# EAGLE design main (EAGLE 9.6.2)
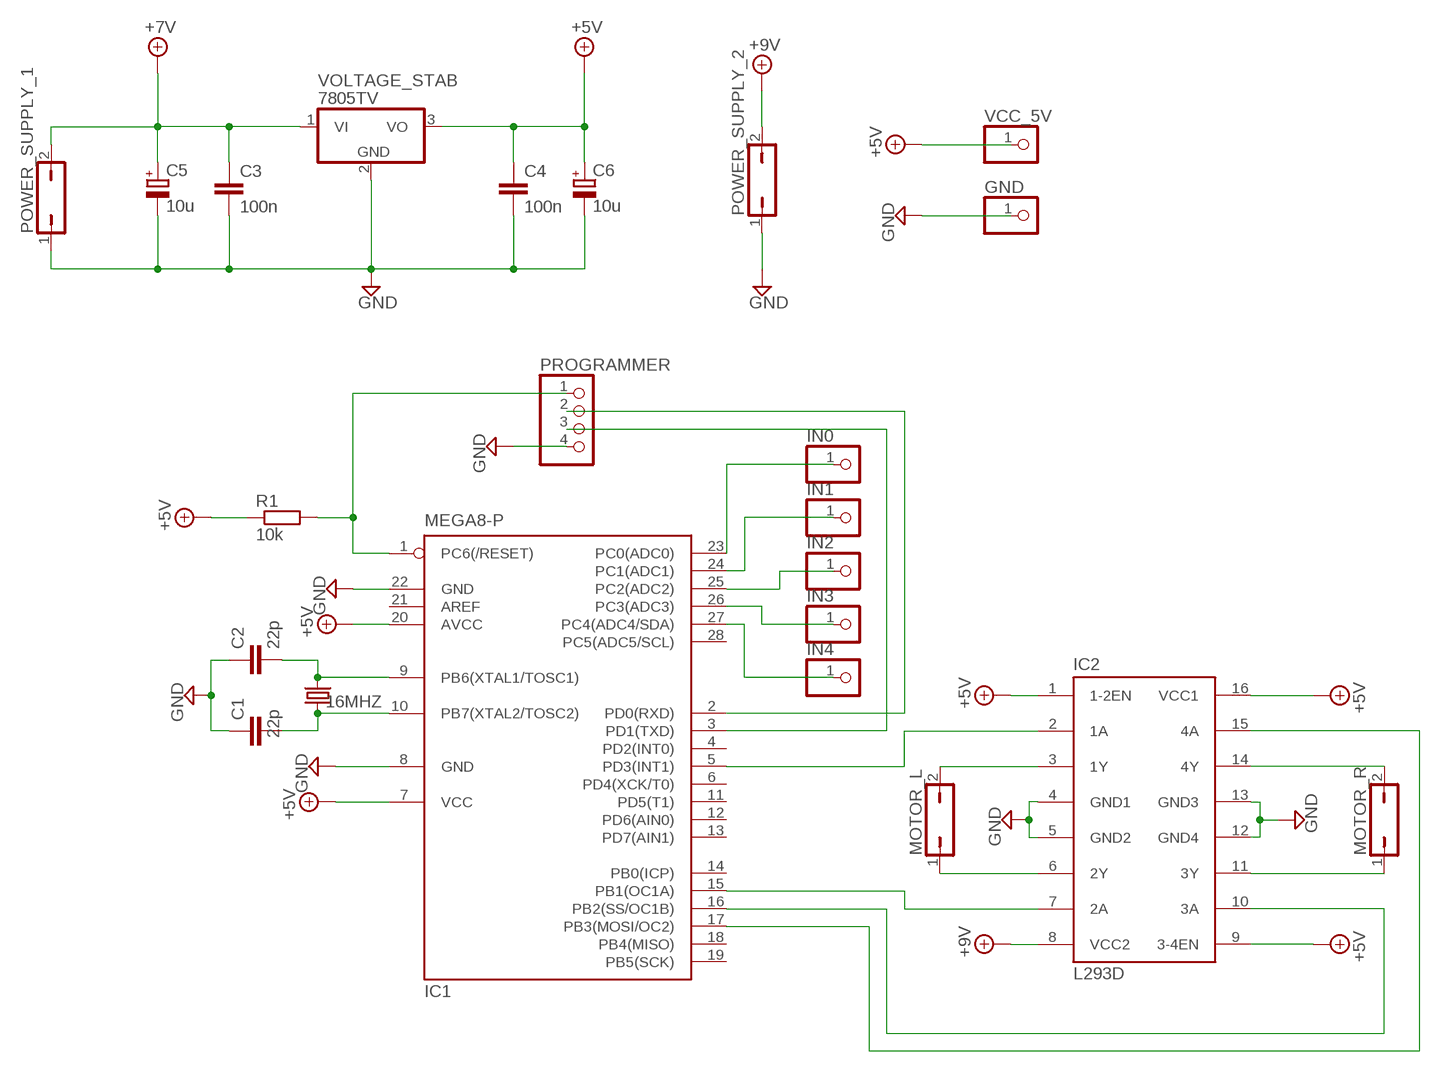
[diagram p0: schematic, sheet 1]

## Parts
16MHZ  CRYSTALHC49S  [HC49/S]
C1  22p  C-EU025-030X050  [C025-030X050]
C2  22p  C-EU025-030X050  [C025-030X050]
C3  100n  C-EU025-030X050  [C025-030X050]
C4  100n  C-EU025-030X050  [C025-030X050]
C5  10u  CPOL-EUE2.5-7  [E2,5-7]
C6  10u  CPOL-EUE2.5-7  [E2,5-7]
GND  PINHD-1X1  [1X01]
IC1  MEGA8-P  [DIL28-3]
IC2  L293D  [DIL16]
IN0  PINHD-1X1  [1X01]
IN1  PINHD-1X1  [1X01]
IN2  PINHD-1X1  [1X01]
IN3  PINHD-1X1  [1X01]
IN4  PINHD-1X1  [1X01]
MOTOR_L  JP1Q  [JP1]
MOTOR_R  JP1Q  [JP1]
POWER_SUPPLY_1  JP1Q  [JP1]
POWER_SUPPLY_2  JP1Q  [JP1]
PROGRAMMER  PINHD-1X4  [1X04]
R1  10k  R-EU_0204/5  [0204/5]
VCC_5V  PINHD-1X1  [1X01]
VOLTAGE_STAB  7805TV  [TO220V]

## Nets
+5V: C4.1 C6.+ IC1.7(VCC) IC1.20(AVCC) IC2.1(1-2EN) IC2.9(3-4EN) IC2.16(VCC1) R1.1 VCC_5V.1 VOLTAGE_STAB.3(VO)
+7V: C3.1 C5.+ POWER_SUPPLY_1.2 VOLTAGE_STAB.1(VI)
+9V: IC2.8(VCC2) POWER_SUPPLY_2.2
GND: C1.1 C2.1 C3.2 C4.2 C5.- C6.- GND.1 IC1.8(GND) IC1.22(GND) IC2.4(GND1) IC2.5(GND2) IC2.12(GND4) IC2.13(GND3) POWER_SUPPLY_1.1 POWER_SUPPLY_2.1 PROGRAMMER.4 VOLTAGE_STAB.2(GND)
MOTOR_L_1: IC1.5(PD3(INT1)) IC2.2(1A)
MOTOR_L_2: IC1.15(PB1(OC1A)) IC2.7(2A)
MOTOR_R2: IC1.17(PB3(MOSI/OC2)) IC2.15(4A)
MOTOR_R_1: IC1.16(PB2(SS/OC1B)) IC2.10(3A)
N$1: IC2.11(3Y) MOTOR_R.1
N$2: IC2.14(4Y) MOTOR_R.2
N$3: IC2.3(1Y) MOTOR_L.2
N$4: IC2.6(2Y) MOTOR_L.1
N$5: 16MHZ.2 C2.2 IC1.9(PB6(XTAL1/TOSC1))
N$6: 16MHZ.1 C1.2 IC1.10(PB7(XTAL2/TOSC2))
N$7: IC1.23(PC0(ADC0)) IN0.1
N$8: IC1.24(PC1(ADC1)) IN1.1
N$9: IC1.25(PC2(ADC2)) IN2.1
N$10: IC1.27(PC4(ADC4/SDA)) IN4.1
N$11: IC1.26(PC3(ADC3)) IN3.1
N$13: IC1.3(PD1(TXD)) PROGRAMMER.3
N$14: IC1.2(PD0(RXD)) PROGRAMMER.2
RESET: IC1.1(PC6(/RESET)) PROGRAMMER.1 R1.2
Unconnected: IC1.4(PD2(INT0)) IC1.6(PD4(XCK/T0)) IC1.11(PD5(T1)) IC1.12(PD6(AIN0)) IC1.13(PD7(AIN1)) IC1.14(PB0(ICP)) IC1.18(PB4(MISO)) IC1.19(PB5(SCK)) IC1.21(AREF) IC1.28(PC5(ADC5/SCL))

## Library data of the parts
16MHZ = crystal:CRYSTAL: CRYSTAL; OC_FARNELL: 1667008; OC_NEWARK: unknown
C1-C4 = rcl:C-EU: CAPACITOR, European symbol; SPICEPREFIX: C
C5 C6 = rcl:CPOL-EU: POLARIZED CAPACITOR, European symbol; SPICEPREFIX: C
GND IN0 IN1-IN4 VCC_5V = pinhead:PINHD-1X1: PIN HEADER
IC1 = atmel:MEGA8-P: MICROCONTROLLER 8 Kbytes FLASH, 1 kbytes SRAM, 512 bytes EEPROM, USART, 4-channel 10 bit ADC, 2-channel 8 bit ADC Pin compatible with Atmega48, ATMega88, ATMega168 Source: avr.lbr; OC_FARNELL: unknown; OC_NEWARK: unknown
IC2 = st-microelectronics:L293D: PUSH-PULL 4 CHANNEL DRIVER; MPN: L293D; OC_FARNELL: 9589619; OC_NEWARK: 56P8249
MOTOR_L MOTOR_R POWER_SUPPLY_1 POWER_SUPPLY_2 = jumper:JP1Q: JUMPER
PROGRAMMER = pinhead:PINHD-1X4: PIN HEADER
R1 = rcl:R-EU_: RESISTOR, European symbol; SPICEPREFIX: R
VOLTAGE_STAB = linear:78*: Positive VOLTAGE REGULATOR Source: http://cache.national.com/ds/LM/LM78L05.pdf http://www.fairchildsemi.com/ds/LM/LM7805.pdf

## Board
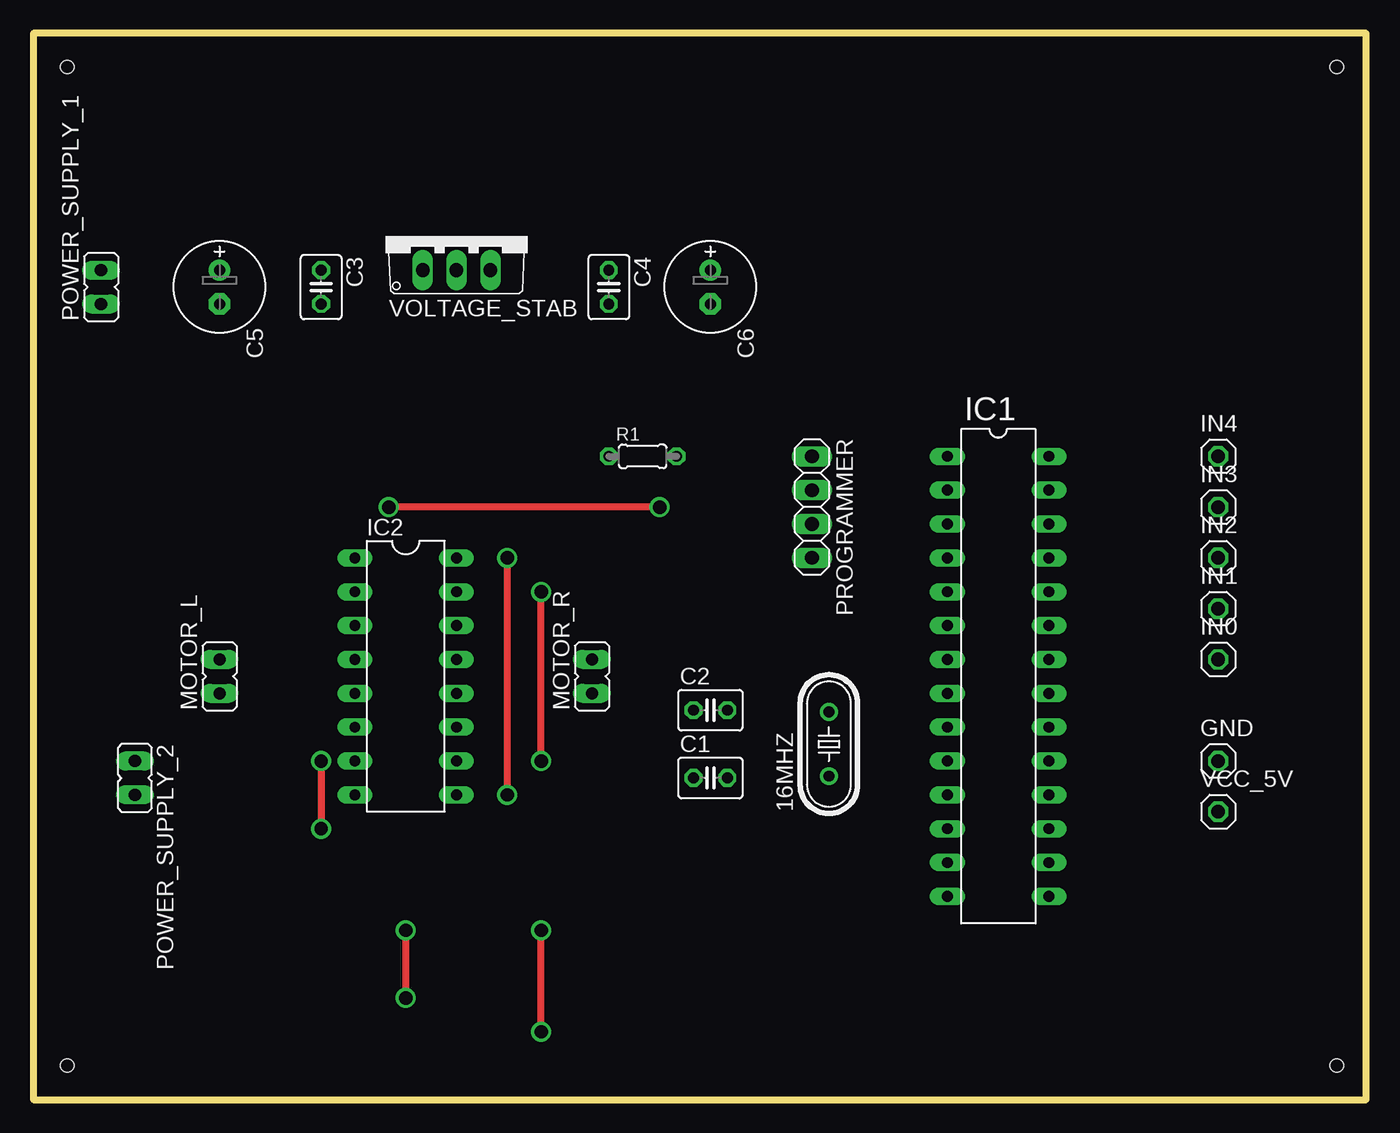
[diagram p1: board, top side]
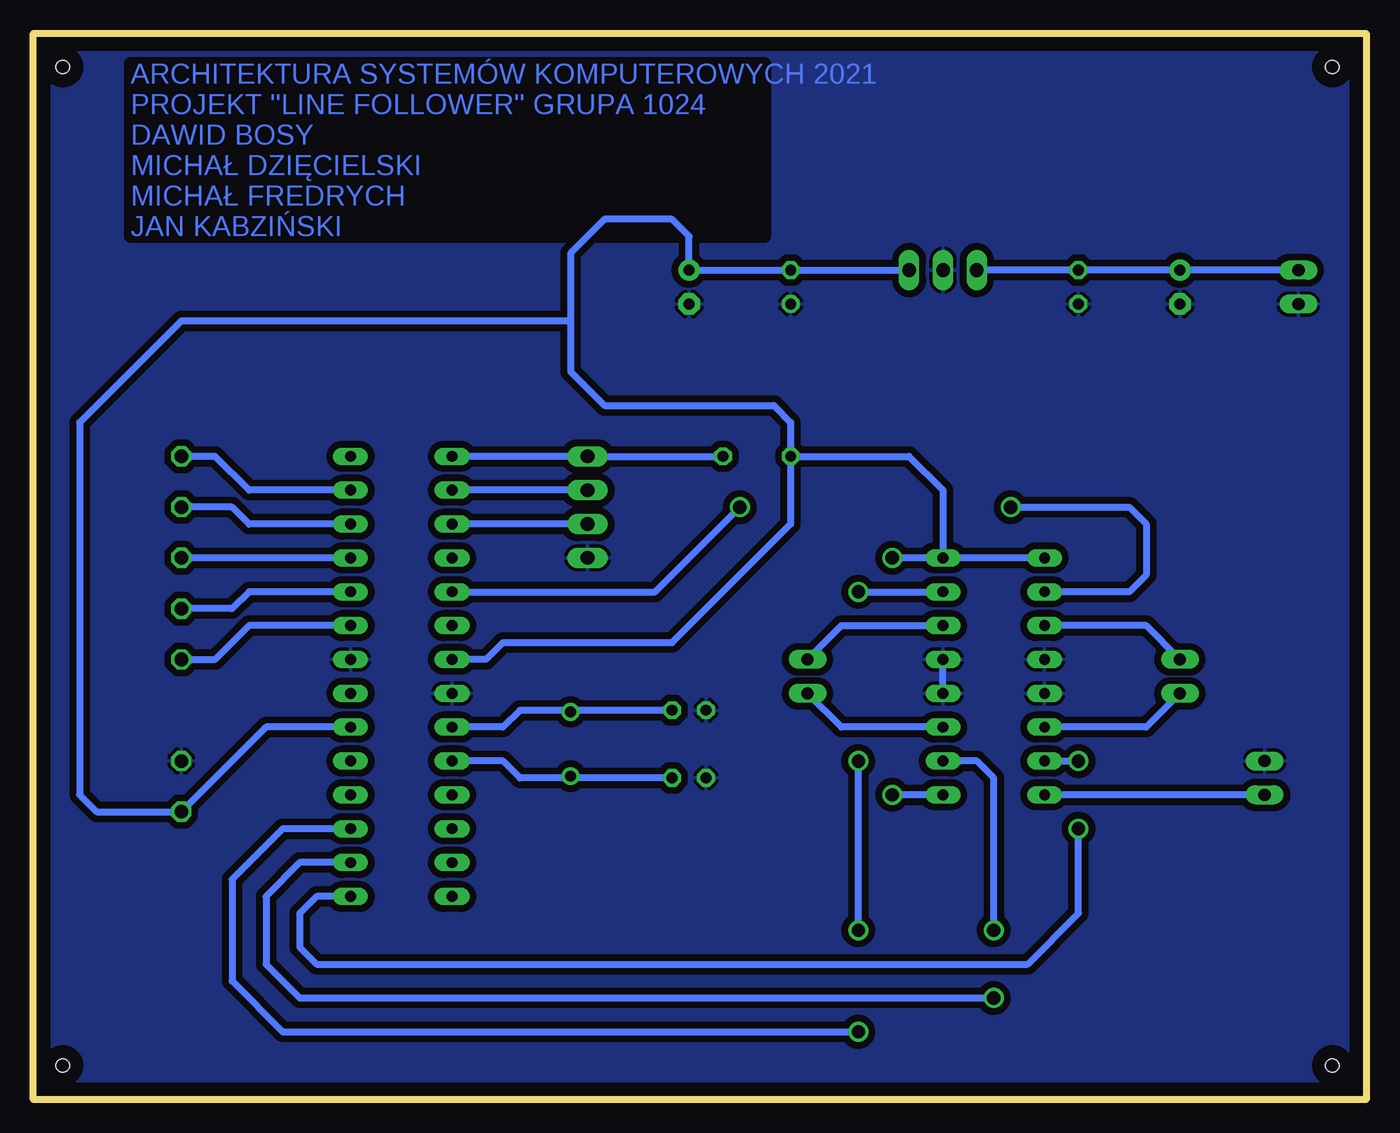
[diagram p2: board, bottom side, seen from below]

Size 100 x 80 mm. Coordinates in mm from the lower left corner, seen from the top.
Outline: 0,0 100,0 100,80 0,80 0,0
Copper layers (1*16): Top 0.035mm / dielectric 1.5mm / Bottom 0.035mm
Design rules "default": minimum track width 6mil, minimum drill 0.35mm, track to track 6mil, track to pad 6mil, pad to pad 6mil, via to via 6mil, smd to smd 6mil, copper to edge 40mil, drill to drill 6mil, minimum pad ring 10mil, minimum via ring 8mil, stop-mask expansion 4mil, vias tented up to drill 0mil, thermal gap 10mil
Holes 1 mm at 2.54,77.47 2.54,2.54 97.79,2.54 97.79,77.47

### Footprints (pad centres in the part's own frame; a part is rotated, then mirrored left to right if it is on the bottom)
HC49/S = drill 0.813: 1 -2.413,0; 2 2.413,0
C025-030X050 = drill 0.813 octagon: 1 -1.27,0; 2 1.27,0
E2,5-7 = drill 0.813 pad 1.6: + -1.27,0 | drill 0.813 pad 1.6 octagon: - 1.27,0
1X01 = drill 1.016 octagon: 1 0,0
DIL28-3 = drill 0.813 long: 1 -16.51,-3.81; 2 -13.97,-3.81; 3 -11.43,-3.81; 4 -8.89,-3.81; 5 -6.35,-3.81; 6 -3.81,-3.81; 7 -1.27,-3.81; 8 1.27,-3.81; 9 3.81,-3.81; 10 6.35,-3.81; 11 8.89,-3.81; 12 11.43,-3.81; 13 13.97,-3.81; 14 16.51,-3.81; 15 16.51,3.81; 16 13.97,3.81; 17 11.43,3.81; 18 8.89,3.81; 19 6.35,3.81; 20 3.81,3.81; 21 1.27,3.81; 22 -1.27,3.81; 23 -3.81,3.81; 24 -6.35,3.81; 25 -8.89,3.81; 26 -11.43,3.81; 27 -13.97,3.81; 28 -16.51,3.81
DIL16 = drill 0.813 long: 1 -8.89,-3.81; 2 -6.35,-3.81; 3 -3.81,-3.81; 4 -1.27,-3.81; 5 1.27,-3.81; 6 3.81,-3.81; 7 6.35,-3.81; 8 8.89,-3.81; 9 8.89,3.81; 10 6.35,3.81; 11 3.81,3.81; 12 1.27,3.81; 13 -1.27,3.81; 14 -3.81,3.81; 15 -6.35,3.81; 16 -8.89,3.81
JP1 = drill 0.914 long: 1 0,-1.27; 2 0,1.27
1X04 = drill 1.016 long: 1 -3.81,0; 2 -1.27,0; 3 1.27,0; 4 3.81,0
0204/5 = drill 0.813 octagon: 1 -2.54,0; 2 2.54,0
TO220V = drill 1.016 long: 1 -2.54,-2.54; 2 0,-2.54; 3 2.54,-2.54

### Placement (x,y rotation side)
16MHZ  59.69,26.67 90 top
C1  50.8,24.13 0 top
C2  50.8,29.21 0 top
C3  21.59,60.96 270 top
C4  43.18,60.96 270 top
C5  13.97,60.96 270 top
C6  50.8,60.96 270 top
GND  88.9,25.4 0 top
IC1  72.39,31.75 270 top
IC2  27.94,31.75 270 top
IN0  88.9,33.02 0 top
IN1  88.9,36.83 0 top
IN2  88.9,40.64 0 top
IN3  88.9,44.45 0 top
IN4  88.9,48.26 0 top
MOTOR_L  13.97,31.75 0 top
MOTOR_R  41.91,31.75 0 top
POWER_SUPPLY_1  5.08,60.96 0 top
POWER_SUPPLY_2  7.62,24.13 180 top
PROGRAMMER  58.42,44.45 270 top
R1  45.72,48.26 0 top
VCC_5V  88.9,21.59 0 top
VOLTAGE_STAB  31.75,64.77 0 top

### Tracks (layer width: path | path; a pad name or v marks a point on that pad's centre or on a via)
+5V  (via drill 1)
  Top 0.508: v35.56,40.64 v35.56,22.86
  Bottom 0.508: VOLTAGE_STAB.3 C4.1 C6.+ 50.8,64.77 52.07,66.04 57.15,66.04 59.69,63.5 59.69,58.42 | R1.1 43.18,50.8 44.45,52.07 57.15,52.07 59.69,54.61 59.69,58.42 | R1.1 43.18,43.18 52.07,34.29 64.77,34.29 66.04,33.02 IC1.7 | IC2.1 IC2.16 | IC2.16 v35.56,40.64 | R1.1 34.29,48.26 31.75,45.72 IC2.16 | IC2.9 v35.56,22.86 | 59.69,58.42 88.9,58.42 96.52,50.8 96.52,22.86 95.25,21.59 VCC_5V.1 82.55,27.94 IC1.20
+7V
  Bottom 0.508: POWER_SUPPLY_1.2 C5.+ C3.1 VOLTAGE_STAB.1
+9V
  Bottom 0.508: POWER_SUPPLY_2.2 IC2.8
GND
  Bottom 0.508: IC2.12 IC2.13
  pour Bottom (isolate 0.508): 1.27,78.74 1.27,1.27 99.06,1.27 99.06,78.74
MOTOR_L_1  (via drill 1)
  Top 0.508: v46.99,44.45 v26.67,44.45
  Bottom 0.508: IC2.2 17.78,38.1 16.51,39.37 16.51,43.18 17.78,44.45 v26.67,44.45 | IC1.5 53.34,38.1 v46.99,44.45
MOTOR_L_2  (via drill 1)
  Top 0.508: v21.59,25.4 v21.59,20.32
  Bottom 0.508: IC2.7 v21.59,25.4 | v21.59,20.32 21.59,13.97 25.4,10.16 78.74,10.16 80.01,11.43 80.01,13.97 78.74,15.24 IC1.15
MOTOR_R2  (via drill 1)
  Top 0.508: v38.1,5.08 v38.1,12.7 | v38.1,25.4 v38.1,38.1
  Bottom 0.508: IC1.17 81.28,20.32 85.09,16.51 85.09,8.89 81.28,5.08 v38.1,5.08 | v38.1,12.7 v38.1,25.4 | v38.1,38.1 IC2.15
MOTOR_R_1  (via drill 1)
  Top 0.508: v27.94,12.7 v27.94,7.62
  Bottom 0.508: 30.48,25.4 IC2.10 29.21,25.4 27.94,24.13 v27.94,12.7 | IC1.16 80.01,17.78 82.55,15.24 82.55,10.16 80.01,7.62 v27.94,7.62
N$1
  Bottom 0.508: IC2.11 39.37,27.94 MOTOR_R.1
N$2
  Bottom 0.508: MOTOR_R.2 39.37,35.56 IC2.14
N$3
  Bottom 0.508: MOTOR_L.2 16.51,35.56 IC2.3
N$4
  Bottom 0.508: MOTOR_L.1 16.51,27.94 IC2.6
N$5
  Bottom 0.508: IC1.9 64.77,27.94 63.5,29.21 59.82,29.21 16MHZ.2 59.56,29.21 C2.2
N$6
  Bottom 0.508: 16MHZ.1 59.75,24.19 | 59.75,24.19 59.82,24.13 63.5,24.13 64.77,25.4 IC1.10 | C1.2 59.69,24.13 59.75,24.19
N$7
  Bottom 0.508: IC1.23 83.82,35.56 86.36,33.02 IN0.1
N$8
  Bottom 0.508: IC1.24 83.82,38.1 85.09,36.83 IN1.1
N$9
  Bottom 0.508: IC1.25 IN2.1
N$10
  Bottom 0.508: IC1.27 83.82,45.72 86.36,48.26 IN4.1
N$11
  Bottom 0.508: IC1.26 83.82,43.18 85.09,44.45 IN3.1
N$13
  Bottom 0.508: PROGRAMMER.3 IC1.3
N$14
  Bottom 0.508: PROGRAMMER.2 IC1.2
RESET
  Bottom 0.508: IC1.1 PROGRAMMER.1 R1.2

### Text on the board
Bottom: ARCHITEKTURA SYSTEMÓW KOMPUTEROWYCH 2021 / PROJEKT ''LINE FOLLOWER'' GRUPA 1024 / DAWID BOSY / MICHAŁ DZIĘCIELSKI / MICHAŁ FREDRYCH / JAN KABZIŃSKI